# Altium schematic sheet COMBINED_HEADER_WRP.SchDoc
size B
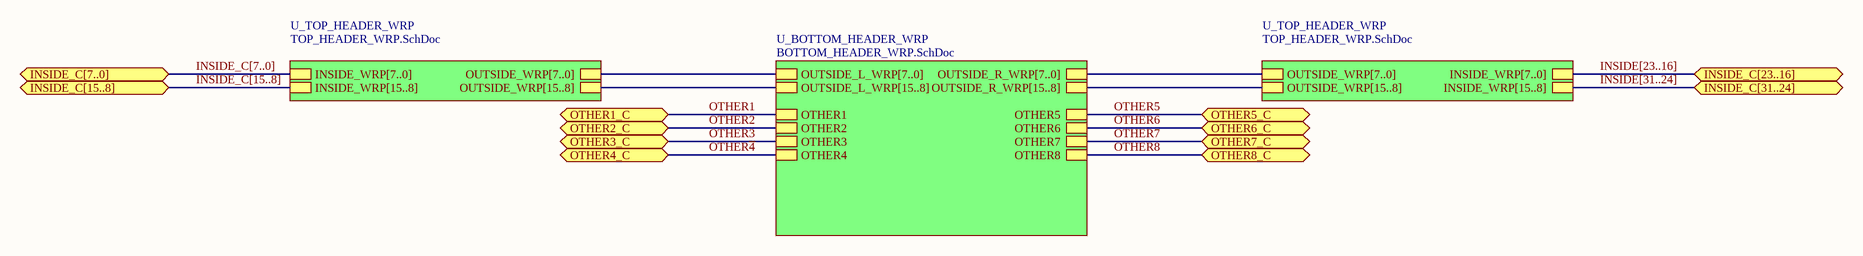
[diagram p0: COMBINED_HEADER_WRP.SchDoc]

## Sub-sheets
U_BOTTOM_HEADER_WRP = BOTTOM_HEADER_WRP.SchDoc: OUTSIDE_L_WRP[7..0], OUTSIDE_R_WRP[7..0], OUTSIDE_L_WRP[15..8], OUTSIDE_R_WRP[15..8], OTHER1, OTHER2, OTHER3, OTHER5, OTHER6, OTHER7, OTHER4, OTHER8
U_TOP_HEADER_WRP = TOP_HEADER_WRP.SchDoc: OUTSIDE_WRP[7..0], INSIDE_WRP[7..0], OUTSIDE_WRP[15..8], INSIDE_WRP[15..8]
U_TOP_HEADER_WRP = TOP_HEADER_WRP.SchDoc: OUTSIDE_WRP[7..0], INSIDE_WRP[7..0], OUTSIDE_WRP[15..8], INSIDE_WRP[15..8]

## Ports
INSIDE_C[7..0], INSIDE_C[15..8], INSIDE_C[23..16], INSIDE_C[31..24], OTHER1_C, OTHER2_C, OTHER3_C, OTHER4_C, OTHER5_C, OTHER6_C, OTHER7_C, OTHER8_C

## Nets
OTHER1: port OTHER1_C, sheet U_BOTTOM_HEADER_WRP/OTHER1
OTHER2: port OTHER2_C, sheet U_BOTTOM_HEADER_WRP/OTHER2
OTHER3: port OTHER3_C, sheet U_BOTTOM_HEADER_WRP/OTHER3
OTHER~{4}: port OTHER4_C, sheet U_BOTTOM_HEADER_WRP/OTHER4
OTHER5: port OTHER5_C, sheet U_BOTTOM_HEADER_WRP/OTHER5
OTHER6: port OTHER6_C, sheet U_BOTTOM_HEADER_WRP/OTHER6
OTHER7: port OTHER7_C, sheet U_BOTTOM_HEADER_WRP/OTHER7
OTHER8: port OTHER8_C, sheet U_BOTTOM_HEADER_WRP/OTHER8

## Buses and harness runs
bus INSIDE[23..16] = port INSIDE_C[23..16] = sheet U_TOP_HEADER_WRP/INSIDE_WRP[7..0]
bus INSIDE[31..24] = port INSIDE_C[31..24] = sheet U_TOP_HEADER_WRP/INSIDE_WRP[15..8]
bus INSIDE_C[7..0] = port INSIDE_C[7..0] = sheet U_TOP_HEADER_WRP/INSIDE_WRP[7..0]
bus INSIDE_C[15..8] = port INSIDE_C[15..8] = sheet U_TOP_HEADER_WRP/INSIDE_WRP[15..8]
bus sheet U_BOTTOM_HEADER_WRP/OUTSIDE_L_WRP[7..0] = sheet U_TOP_HEADER_WRP/OUTSIDE_WRP[7..0]
bus sheet U_BOTTOM_HEADER_WRP/OUTSIDE_L_WRP[15..8] = sheet U_TOP_HEADER_WRP/OUTSIDE_WRP[15..8]
bus sheet U_BOTTOM_HEADER_WRP/OUTSIDE_R_WRP[7..0] = sheet U_TOP_HEADER_WRP/OUTSIDE_WRP[7..0]
bus sheet U_BOTTOM_HEADER_WRP/OUTSIDE_R_WRP[15..8] = sheet U_TOP_HEADER_WRP/OUTSIDE_WRP[15..8]